# EAGLE schematic pcie-host (EAGLE 8.3.2)
DESIGNER: JON NEWMAN; DESIGN_NAME: PCIE HOST BOARD; LICENSE: CERN OHL v1.2; REVISION: 1.2
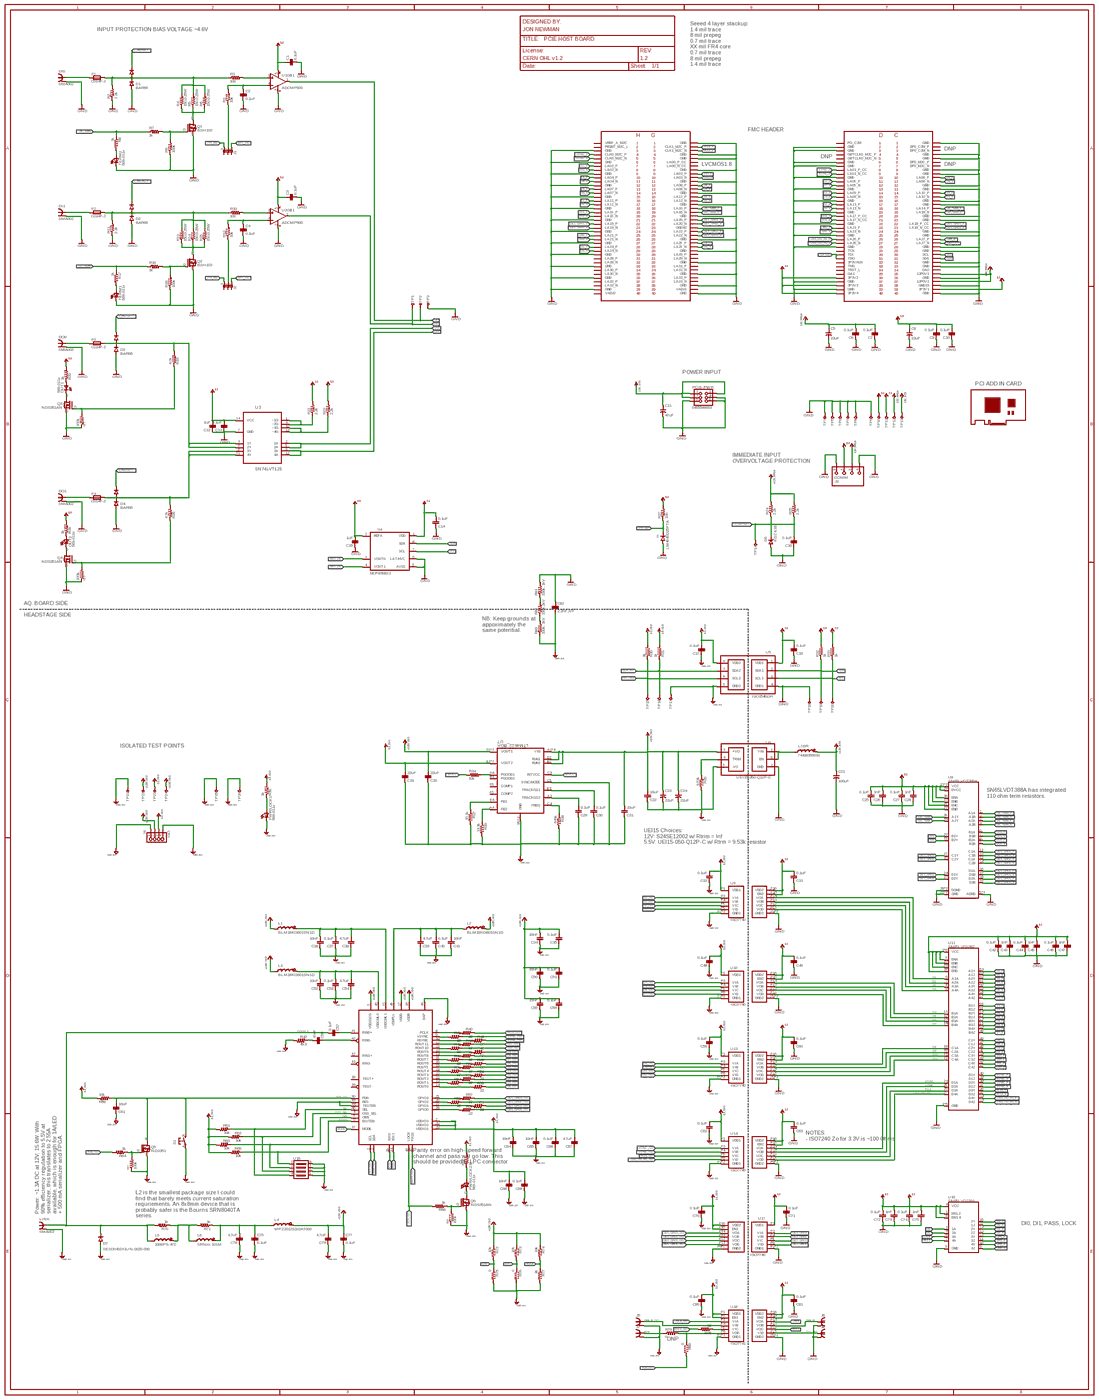
[diagram p0: schematic, sheet 1, overview]
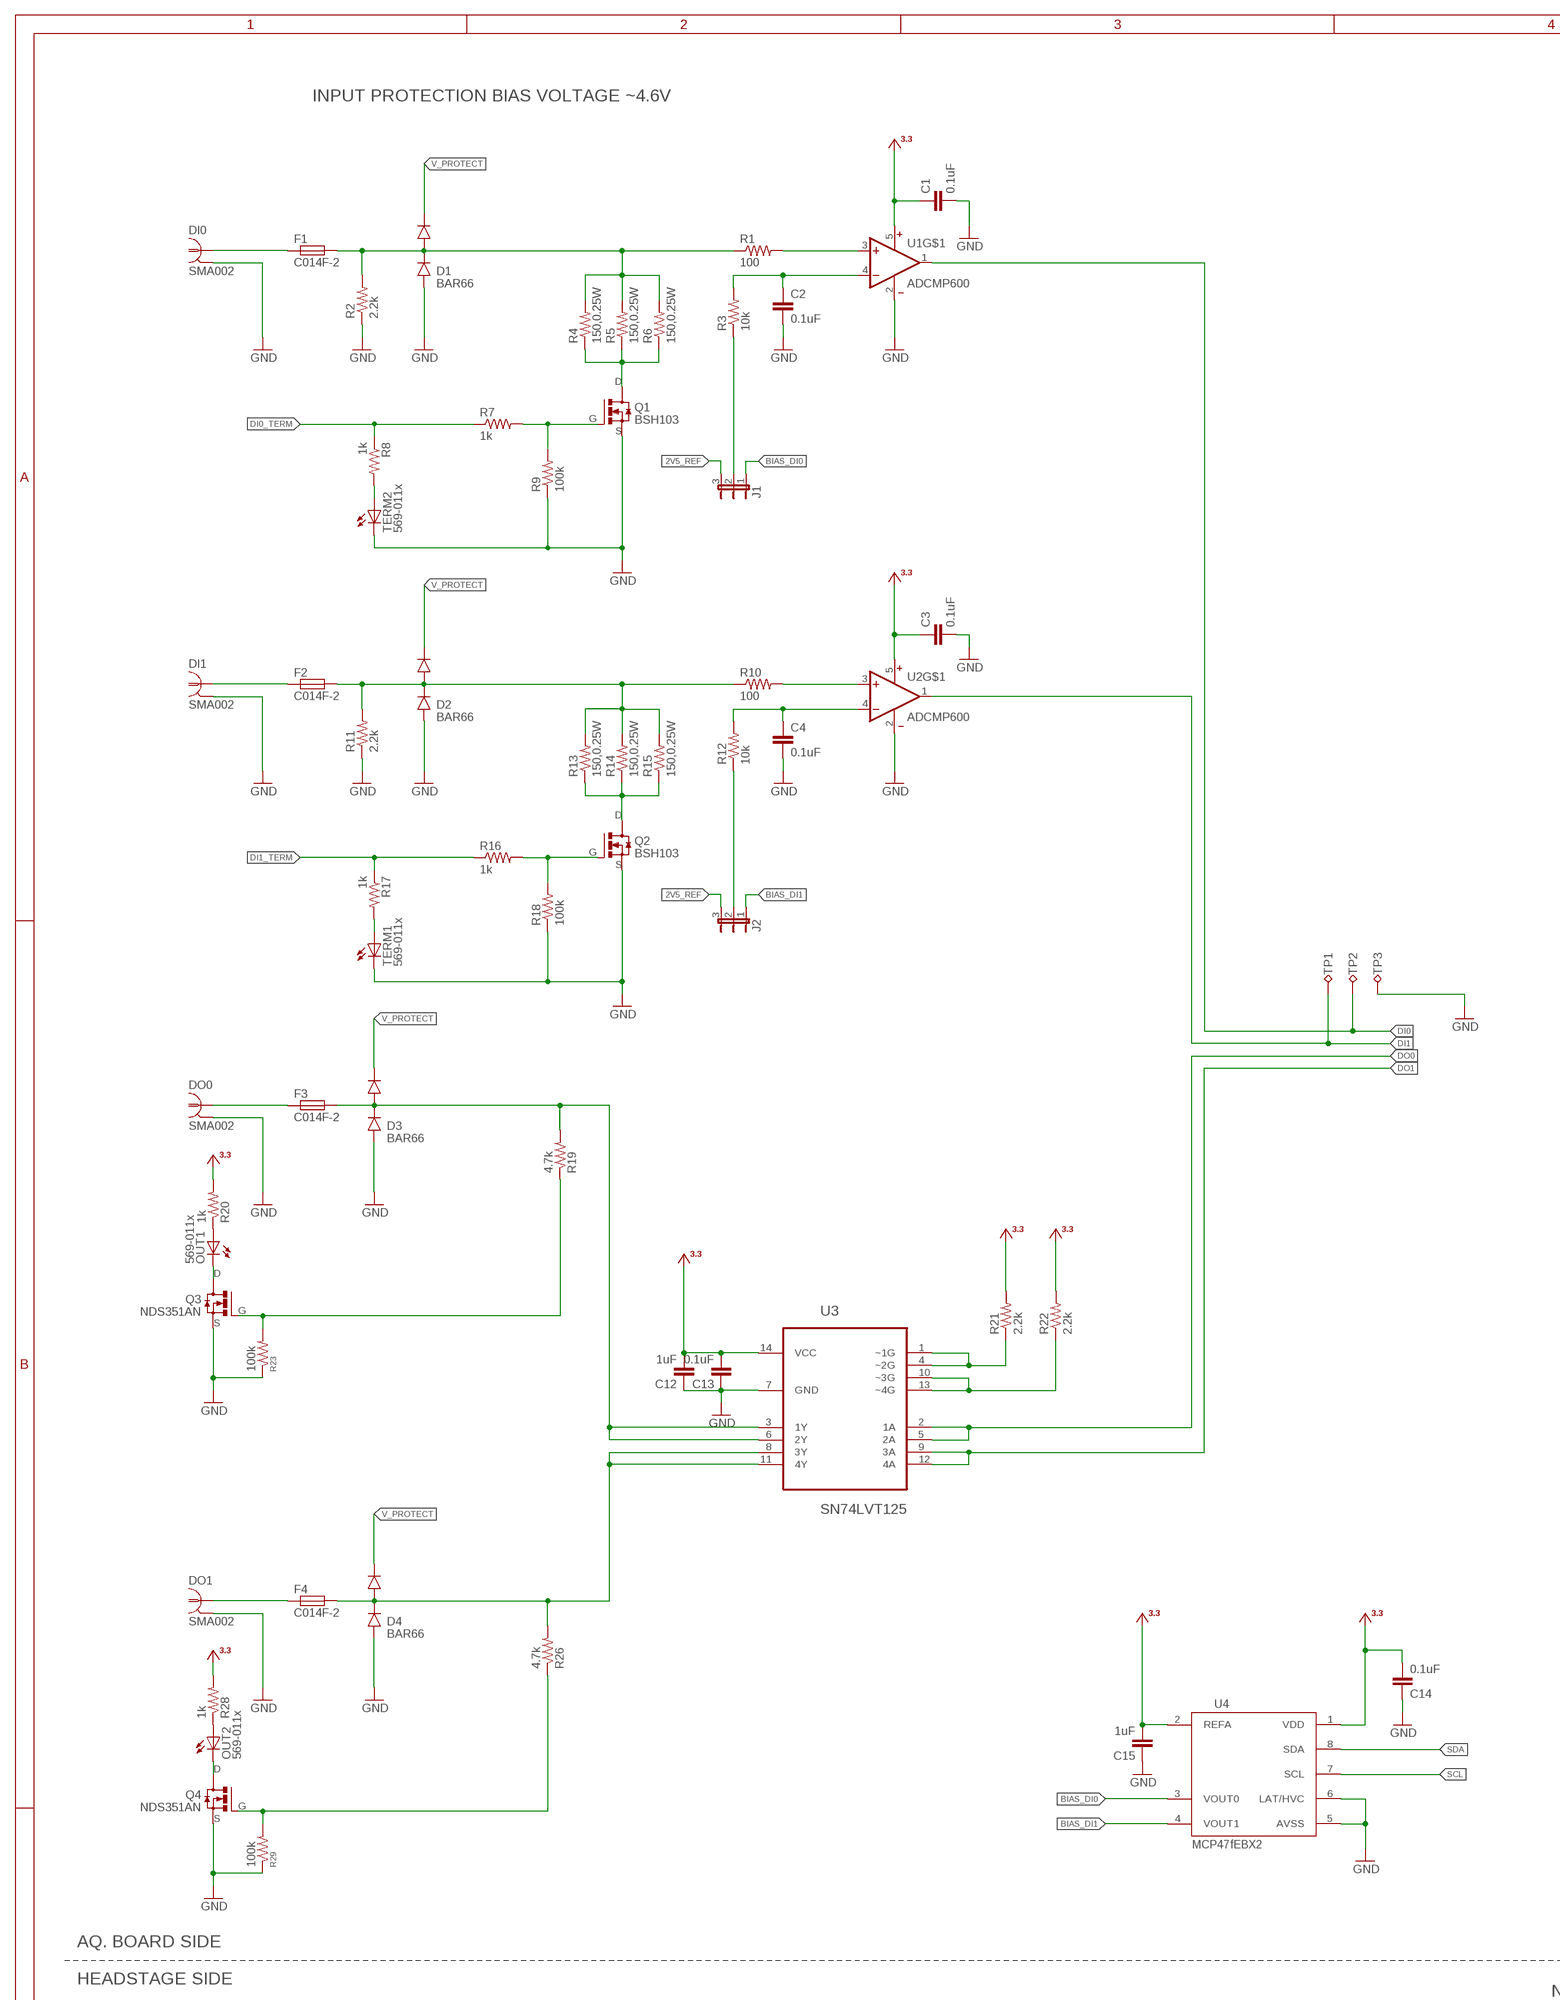
[diagram p1: schematic, sheet 1, part 1 of 4]
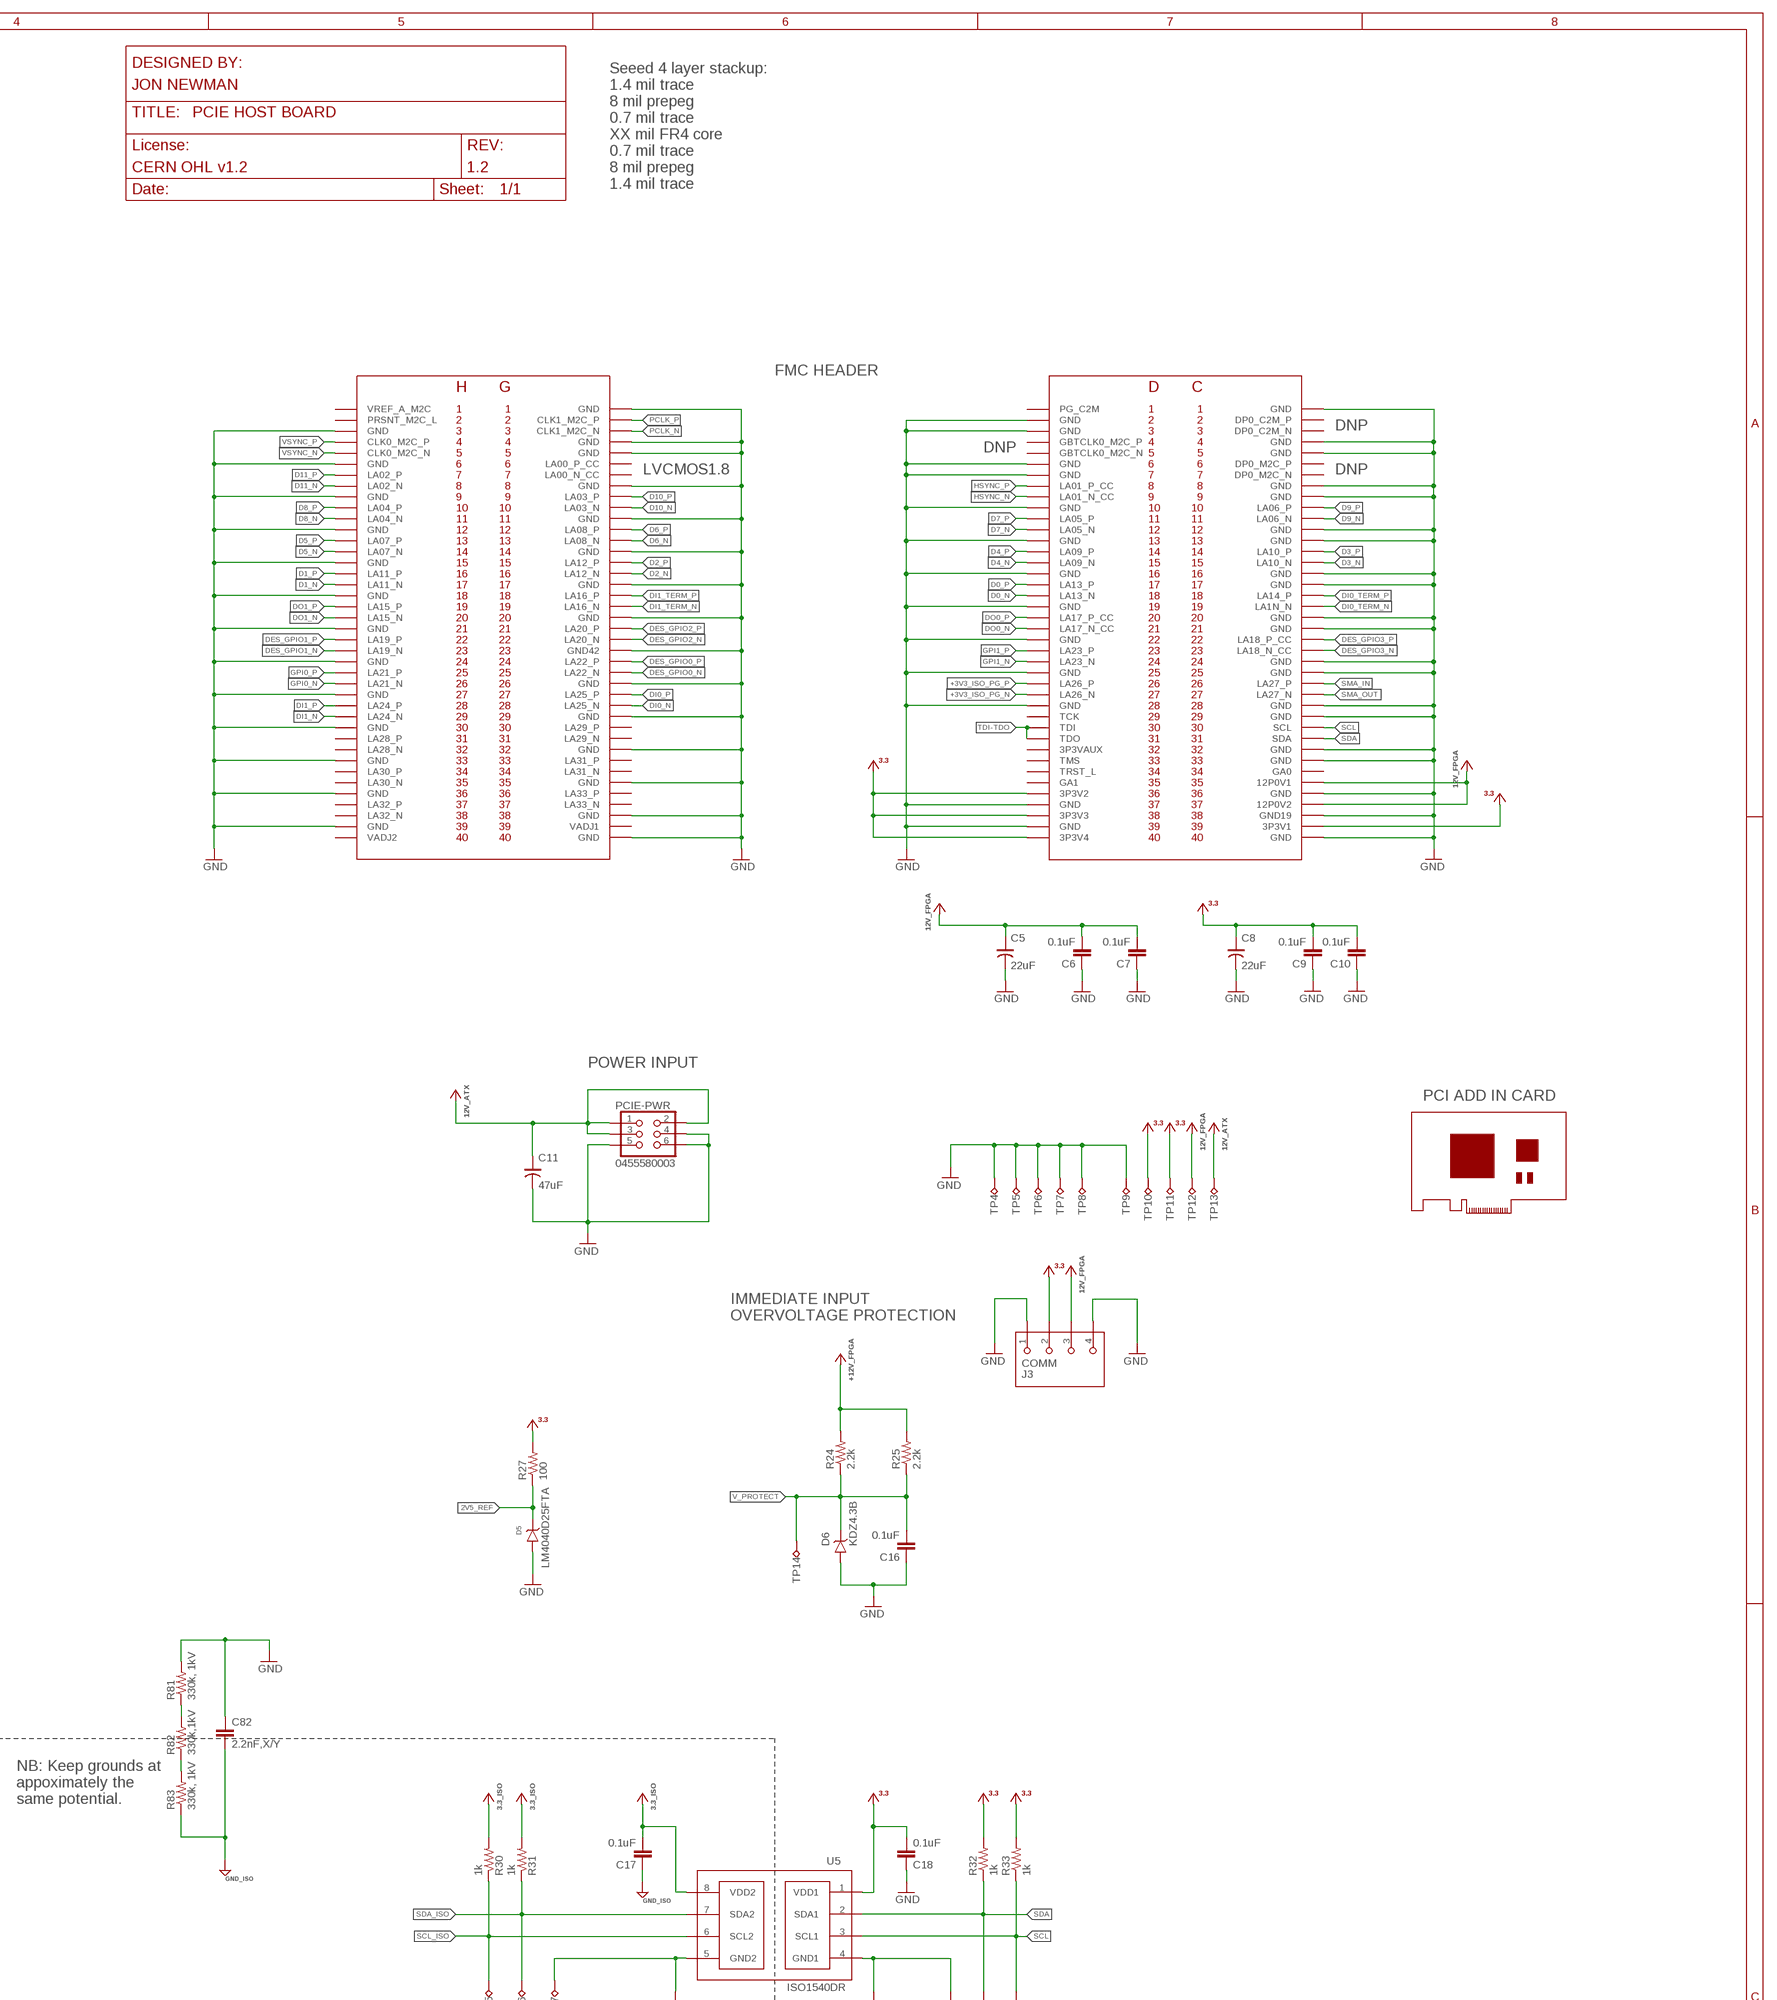
[diagram p2: schematic, sheet 1, part 2 of 4]
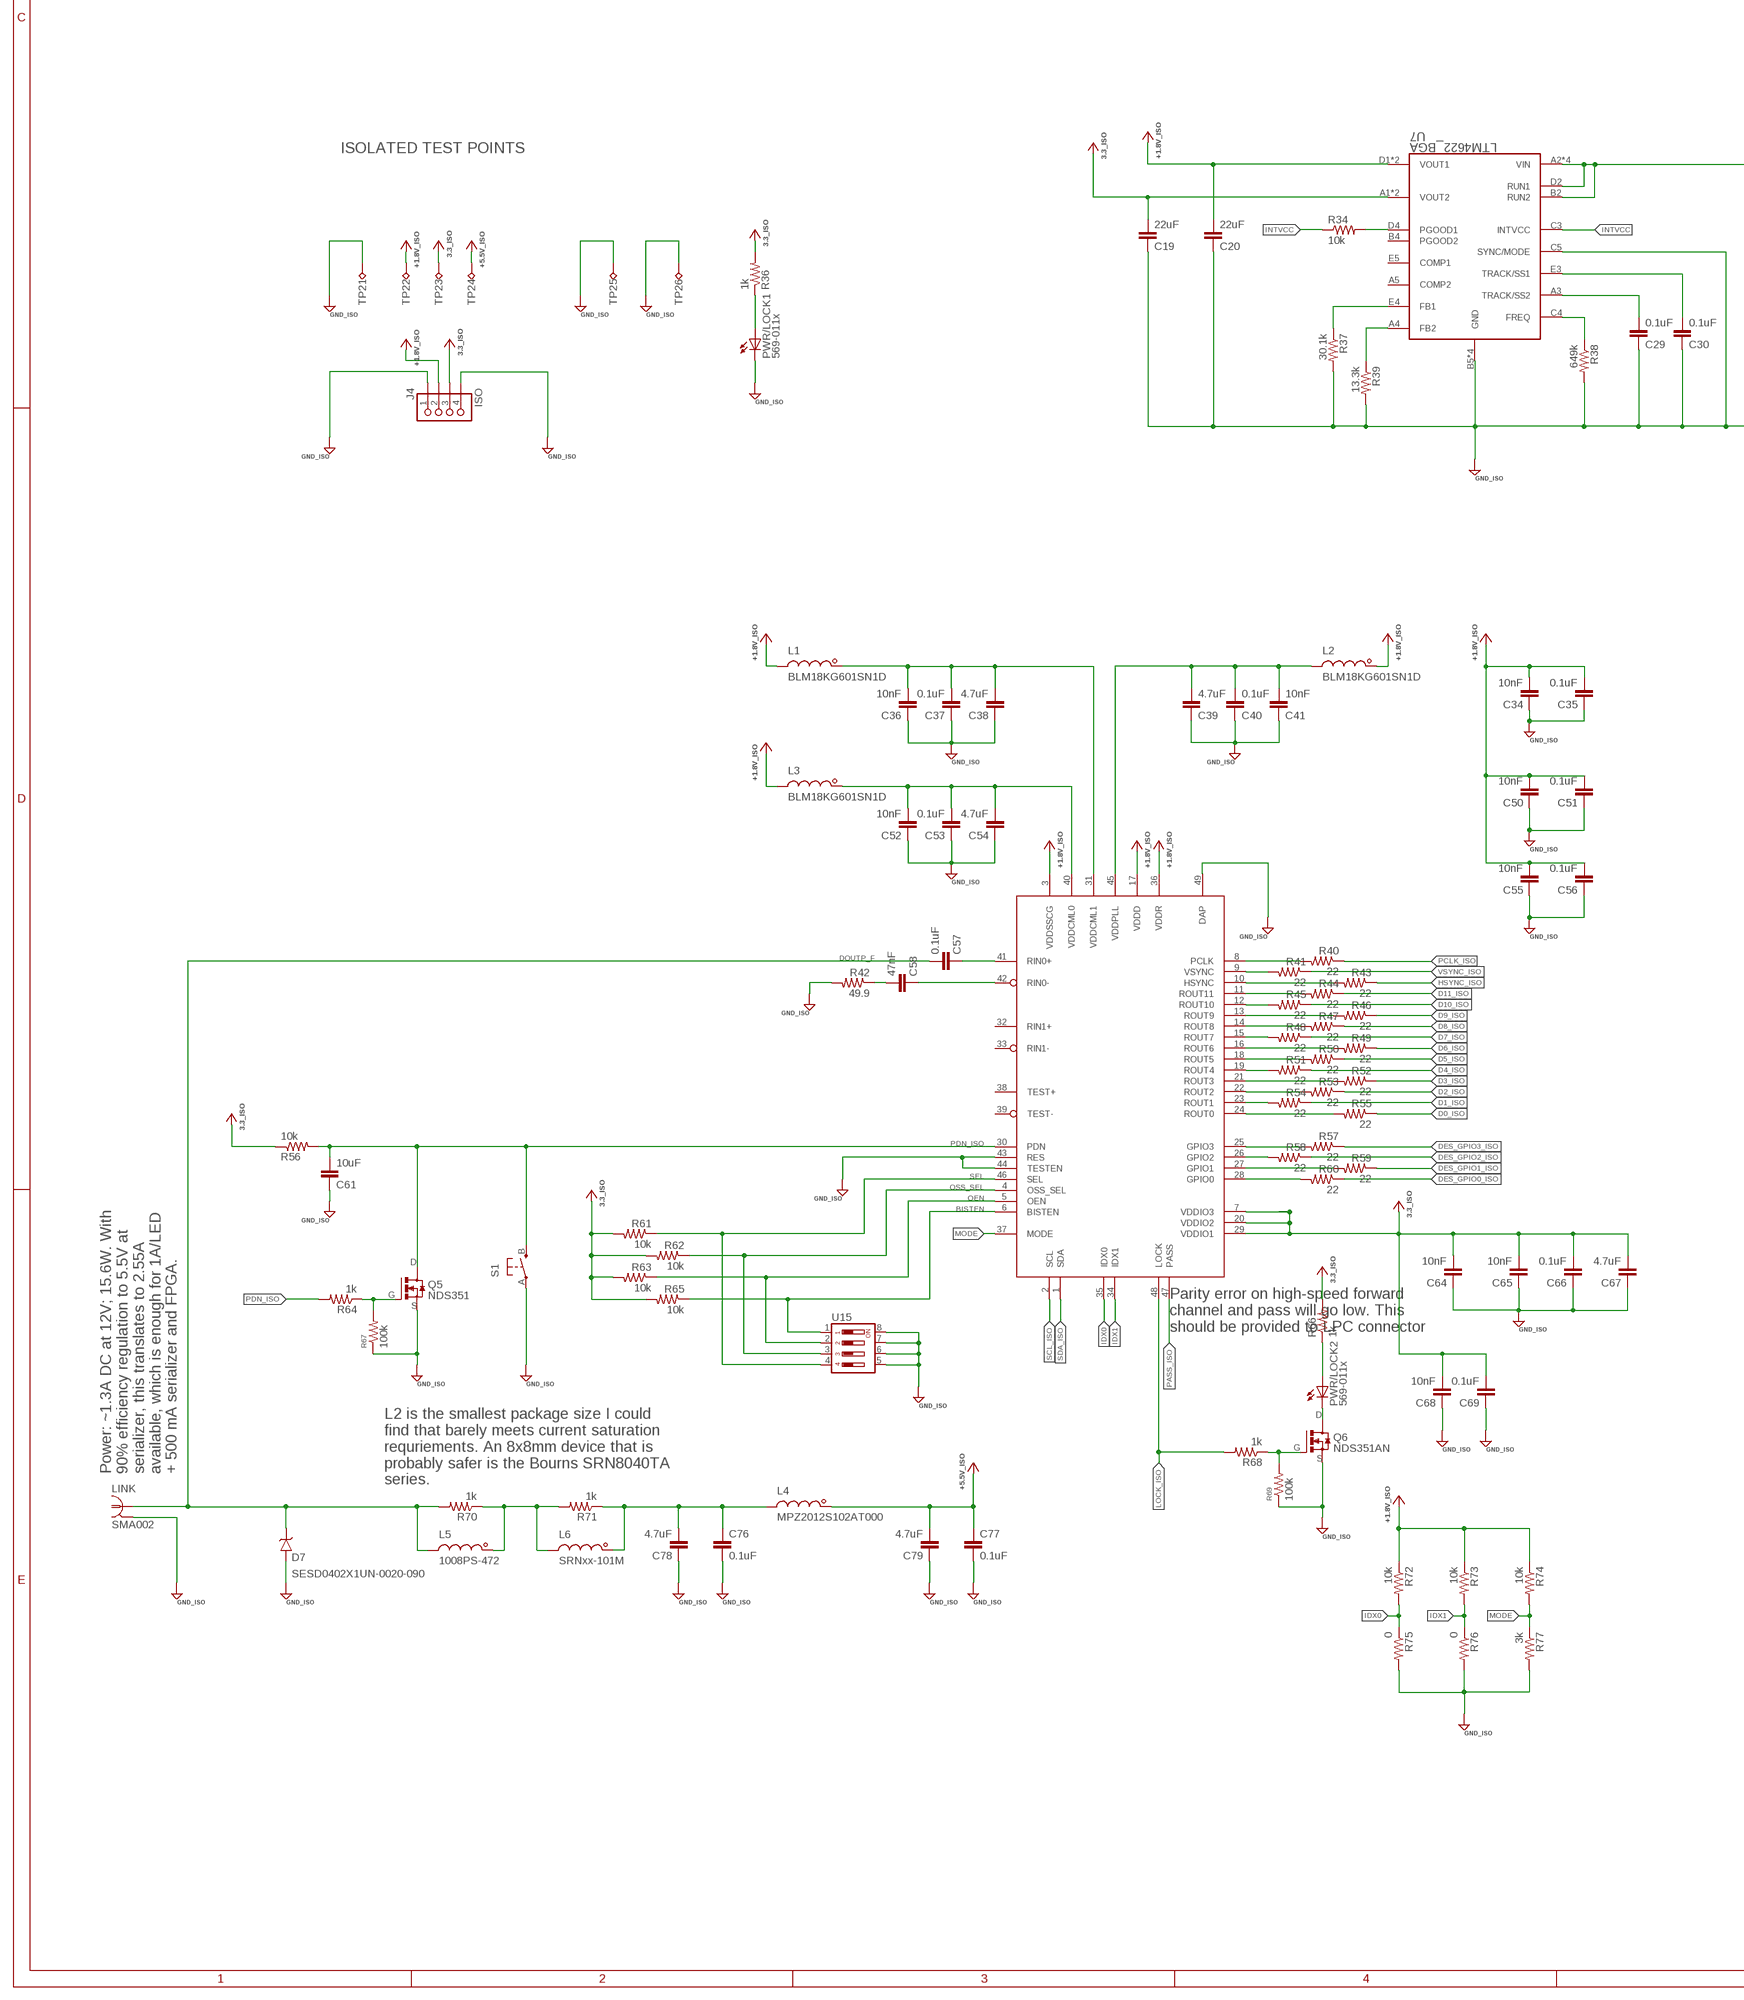
[diagram p3: schematic, sheet 1, part 3 of 4]
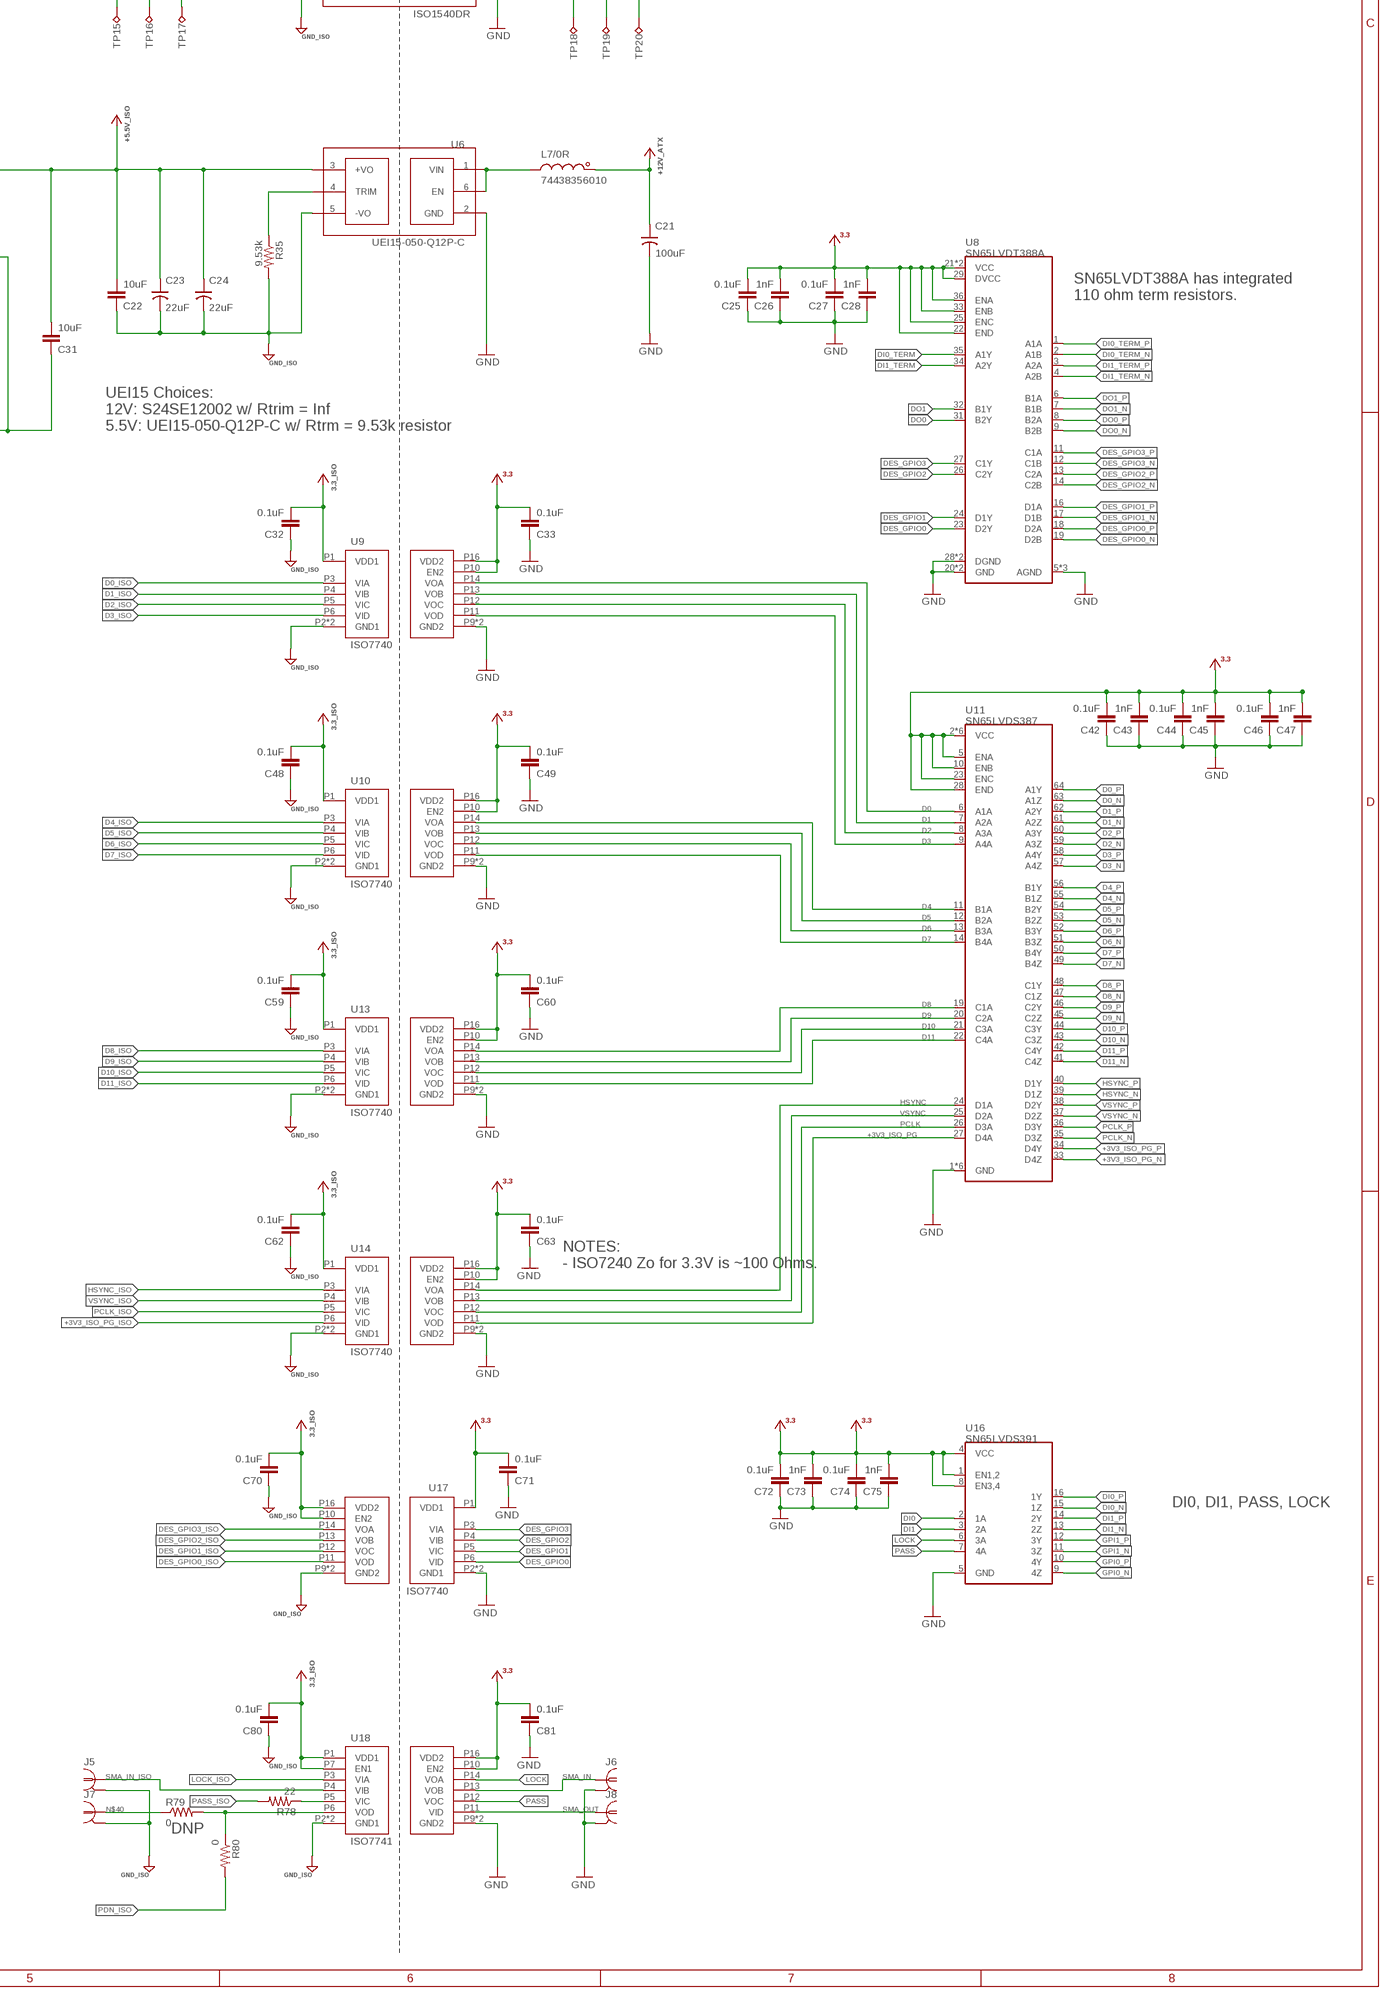
[diagram p4: schematic, sheet 1, part 4 of 4]

## Parts
C1  0.1uF  C_0603  [0603]
C2  0.1uF  C_0603  [0603]
C3  0.1uF  C_0603  [0603]
C4  0.1uF  C_0603  [0603]
C5  22uF  C-POL_1210  [1210-POL]
C6  0.1uF  C_0603  [0603]
C7  0.1uF  C_0603  [0603]
C8  22uF  C-POL_1210  [1210-POL]
C9  0.1uF  C_0603  [0603]
C10  0.1uF  C_0603  [0603]
C11  47uF  C-POL_0807  [153CLV-0807]
C12  1uF  C_0805  [0805]
C13  0.1uF  C_0603  [0603]
C14  0.1uF  C_0603  [0603]
C15  1uF  C_0805  [0805]
C16  0.1uF  C_0603  [0603]
C17  0.1uF  C_0603  [0603]
C18  0.1uF  C_0603  [0603]
C19  22uF  C_1206  [1206]
C20  22uF  C_1206  [1206]
C21  100uF  C-POL_0807  [153CLV-0807]
C22  10uF  C_1206  [1206]
C23  22uF  C-POL_1210  [1210-POL]
C24  22uF  C-POL_1210  [1210-POL]
C25  0.1uF  C_0603  [0603]
C26  1nF  C_0402  [0402]
C27  0.1uF  C_0603  [0603]
C28  1nF  C_0402  [0402]
C29  0.1uF  C_0603  [0603]
C30  0.1uF  C_0603  [0603]
C31  10uF  C_1206  [1206]
C32  0.1uF  C_0603  [0603]
C33  0.1uF  C_0603  [0603]
C34  10nF  C_0402  [0402]
C35  0.1uF  C_0402  [0402]
C36  10nF  C_0402  [0402]
C37  0.1uF  C_0402  [0402]
C38  4.7uF  C_1206  [1206]
C39  4.7uF  C_1206  [1206]
C40  0.1uF  C_0402  [0402]
C41  10nF  C_0402  [0402]
C42  0.1uF  C_0603  [0603]
C43  1nF  C_0402  [0402]
C44  0.1uF  C_0603  [0603]
C45  1nF  C_0402  [0402]
C46  0.1uF  C_0603  [0603]
C47  1nF  C_0402  [0402]
C48  0.1uF  C_0603  [0603]
C49  0.1uF  C_0603  [0603]
C50  10nF  C_0402  [0402]
C51  0.1uF  C_0402  [0402]
C52  10nF  C_0402  [0402]
C53  0.1uF  C_0402  [0402]
C54  4.7uF  C_1206  [1206]
C55  10nF  C_0402  [0402]
C56  0.1uF  C_0402  [0402]
C57  0.1uF  C_0402  [0402]
C58  47nF  C_0402  [0402]
C59  0.1uF  C_0603  [0603]
C60  0.1uF  C_0603  [0603]
C61  10uF  C_1206  [1206]
C62  0.1uF  C_0603  [0603]
C63  0.1uF  C_0603  [0603]
C64  10nF  C_0402  [0402]
C65  10nF  C_0402  [0402]
C66  0.1uF  C_0402  [0402]
C67  4.7uF  C_1206  [1206]
C68  10nF  C_0402  [0402]
C69  0.1uF  C_0402  [0402]
C70  0.1uF  C_0603  [0603]
C71  0.1uF  C_0603  [0603]
C72  0.1uF  C_0603  [0603]
C73  1nF  C_0402  [0402]
C74  0.1uF  C_0603  [0603]
C75  1nF  C_0402  [0402]
C76  0.1uF  C_0603  [0603]
C77  0.1uF  C_0603  [0603]
C78  4.7uF  C_1206  [1206]
C79  4.7uF  C_1206  [1206]
C80  0.1uF  C_0603  [0603]
C81  0.1uF  C_0603  [0603]
C82  2.2nF,X/Y  C_C900  [C900]
D1  BAR66  DIODE2_SOT23  [SOT23]
D2  BAR66  DIODE2_SOT23  [SOT23]
D3  BAR66  DIODE2_SOT23  [SOT23]
D4  BAR66  DIODE2_SOT23  [SOT23]
D5  LM4040D25FTA  Z-DIODE_SOT23  [SOT23]
D6  KDZ4.3B  Z-DIODE_SOD123  [SOD123]
D7  SESD0402X1UN-0020-090  Z-DIODE_0402P-DFN  [0402P-DFN]
DI0  SMA002  COAX_CONREVSMA002-G  [SMA_JACK_CONREVSMA002-G]
DI1  SMA002  COAX_CONREVSMA002-G  [SMA_JACK_CONREVSMA002-G]
DO0  SMA002  COAX_CONREVSMA002-G  [SMA_JACK_CONREVSMA002-G]
DO1  SMA002  COAX_CONREVSMA002-G  [SMA_JACK_CONREVSMA002-G]
F1  C014F-2  FUSE_1812  [1812]
F2  C014F-2  FUSE_1812  [1812]
F3  C014F-2  FUSE_1812  [1812]
F4  C014F-2  FUSE_1812  [1812]
FMC_LPC  FMC_LPC_160_PIN  [FMC_LPC_MALE_WITH_SP601_BSILK]
J1  JP3E  [JP3]
J2  JP3E  [JP3]
J3  COMM  SCREW4  [SCREW4]
J4  ISO  PINHD-1X4  [1X04]
J5  COAX_SMA-VERT-SMA  [SMA_VERT]
J6  COAX_SMA-VERT-SMA  [SMA_VERT]
J7  COAX_SMA-VERT-SMA  [SMA_VERT]
J8  COAX_SMA-VERT-SMA  [SMA_VERT]
L1  BLM18KG601SN1D  L_0603  [0603]
L2  BLM18KG601SN1D  L_0603  [0603]
L3  BLM18KG601SN1D  L_0603  [0603]
L4  MPZ2012S102AT000  L_0805  [0805]
L5  1008PS-472  L_1008PS  [1008PS]
L6  SRNxx-101M  L_SRN6045TA  [SRN6045TA]
L7/0R  74438356010  L_4020  [4020]
LINK  SMA002  COAX_CONREVSMA002-G  [SMA_JACK_CONREVSMA002-G]
OUT  569-011x  LED_2X_VERTICAL  [569-011X-X00_LED_ARRAY]
PCIE-PWR  0455580003  PINHD-2X3_PCIE-PWR  [PCIE-POWER-6PIN]
PWR/LOCK  569-011x  LED_2X_VERTICAL  [569-011X-X00_LED_ARRAY]
Q1  BSH103  N-MOSFET_SOT23-GSD  [SOT23-GSD]
Q2  BSH103  N-MOSFET_SOT23-GSD  [SOT23-GSD]
Q3  NDS351AN  N-MOSFET_SOT23-GSD  [SOT23-GSD]
Q4  NDS351AN  N-MOSFET_SOT23-GSD  [SOT23-GSD]
Q5  NDS351  N-MOSFET_SOT23-GSD  [SOT23-GSD]
Q6  NDS351AN  N-MOSFET_SOT23-GSD  [SOT23-GSD]
R1  100  R_0603  [0603]
R2  2.2k  R_0603  [0603]
R3  10k  R_0603  [0603]
R4  150,0.25W  R_1206  [1206]
R5  150,0.25W  R_1206  [1206]
R6  150,0.25W  R_1206  [1206]
R7  1k  R_0603  [0603]
R8  1k  R_0603  [0603]
R9  100k  R_0603  [0603]
R10  100  R_0603  [0603]
R11  2.2k  R_0603  [0603]
R12  10k  R_0603  [0603]
R13  150,0.25W  R_1206  [1206]
R14  150,0.25W  R_1206  [1206]
R15  150,0.25W  R_1206  [1206]
R16  1k  R_0603  [0603]
R17  1k  R_0603  [0603]
R18  100k  R_0603  [0603]
R19  4.7k  R_0603  [0603]
R20  1k  R_0603  [0603]
R21  2.2k  R_0603  [0603]
R22  2.2k  R_0603  [0603]
R23  100k  R_0603  [0603]
R24  2.2k  R_0603  [0603]
R25  2.2k  R_0603  [0603]
R26  4.7k  R_0603  [0603]
R27  100  R_0603  [0603]
R28  1k  R_0603  [0603]
R29  100k  R_0603  [0603]
R30  1k  R_0603  [0603]
R31  1k  R_0603  [0603]
R32  1k  R_0603  [0603]
R33  1k  R_0603  [0603]
R34  10k  R_0603  [0603]
R35  9.53k  R_0603  [0603]
R36  1k  R_0603  [0603]
R37  30.1k  R_0603  [0603]
R38  649k  R_0603  [0603]
R39  13.3k  R_0603  [0603]
R40  22  R_0402  [0402]
R41  22  R_0402  [0402]
R42  49.9  R_0402  [0402]
R43  22  R_0402  [0402]
R44  22  R_0402  [0402]
R45  22  R_0402  [0402]
R46  22  R_0402  [0402]
R47  22  R_0402  [0402]
R48  22  R_0402  [0402]
R49  22  R_0402  [0402]
R50  22  R_0402  [0402]
R51  22  R_0402  [0402]
R52  22  R_0402  [0402]
R53  22  R_0402  [0402]
R54  22  R_0402  [0402]
R55  22  R_0402  [0402]
R56  10k  R_0402  [0402]
R57  22  R_0402  [0402]
R58  22  R_0402  [0402]
R59  22  R_0402  [0402]
R60  22  R_0402  [0402]
R61  10k  R_0402  [0402]
R62  10k  R_0402  [0402]
R63  10k  R_0402  [0402]
R64  1k  R_0603  [0603]
R65  10k  R_0402  [0402]
R66  1k  R_0603  [0603]
R67  100k  R_0603  [0603]
R68  1k  R_0603  [0603]
R69  100k  R_0603  [0603]
R70  1k  R_0603  [0603]
R71  1k  R_0603  [0603]
R72  10k  R_0402  [0402]
R73  10k  R_0402  [0402]
R74  10k  R_0402  [0402]
R75  0  R_0402  [0402]
R76  0  R_0402  [0402]
R77  3k  R_0402  [0402]
R78  22  R_0402  [0402]
R79  0  R_0402  [0402]
R80  0  R_0402  [0402]
R81  330k, 1kV  R_1206  [1206]
R82  330k,1kV  R_1206  [1206]
R83  330k, 1kV  R_1206  [1206]
S1  SPST_TACT2_EVQPF  [EVQPF]
TERM  569-011x  LED_2X_VERTICAL  [569-011X-X00_LED_ARRAY]
TP1  DI1  TPTP09SQ  [TP09SQ]
TP2  DI0  TPTP09SQ  [TP09SQ]
TP3  GND  TP_0.035IN  [TESTPOINT_0.035IN]
TP4  GND  TP_2MM  [TESTPOINT_2MM]
TP5  GND  TP_2MM  [TESTPOINT_2MM]
TP6  GND  TP_2MM  [TESTPOINT_2MM]
TP7  GND  TP_2MM  [TESTPOINT_2MM]
TP8  GND  TP_2MM  [TESTPOINT_2MM]
TP9  GND  TP_2MM  [TESTPOINT_2MM]
TP10  +3.3V  TP_2MM  [TESTPOINT_2MM]
TP11  +3.3V  TP_2MM  [TESTPOINT_2MM]
TP12  +12V(FPGA)  TP_2MM  [TESTPOINT_2MM]
TP13  +12V(ATX)  TP_2MM  [TESTPOINT_2MM]
TP14  VPROTECT(+4.3V)  TP_0.035IN  [TESTPOINT_0.035IN]
TP15  SCL(ISO)  TP_1MM  [TESTPOINT_1MM]
TP16  SDA(ISO)  TP_1MM  [TESTPOINT_1MM]
TP17  GND(ISO)  TP_1MM  [TESTPOINT_1MM]
TP18  GND  TP_1MM  [TESTPOINT_1MM]
TP19  SDA  TP_1MM  [TESTPOINT_1MM]
TP20  SCL  TP_1MM  [TESTPOINT_1MM]
TP21  GND(ISO)  TP_1MM  [TESTPOINT_1MM]
TP22  +1.8V(ISO)  TP_1MM  [TESTPOINT_1MM]
TP23  +3.3V(ISO)  TP_2MM  [TESTPOINT_2MM]
TP24  +5.5V(ISO)  TP_2MM  [TESTPOINT_2MM]
TP25  GND(ISO)  TP_1MM  [TESTPOINT_1MM]
TP26  GND(ISO)  TP_1MM  [TESTPOINT_1MM]
U1  ADCMP600  COMPARITOR_ADCMP600  [SOT-23-5]
U2  ADCMP600  COMPARITOR_ADCMP600  [SOT-23-5]
U3  SN74LVT125  QUAD-LINE-DRIVER_SOIC  [SO14]
U4  MCP47FEBX2  [TSSOP-8]
U5  ISO1540DR  DIGISO-I2C_SOIC  [SOIC127P500X400-8N]
U6  UEI15-050-Q12P-C  DC-DC-CONVERTER-ADJ_UEI15  [UEI15]
U7  LTM4622_BGA  [BGA_5X5_625X625]
U8  SN65LVDT388A  SN65LVDS388A  [TSSOP-38]
U9  ISO7740  DIGISO-4-0  [SOIC_WIDE_16]
U10  ISO7740  DIGISO-4-0  [SOIC_WIDE_16]
U11  SN65LVDS387  SN65LVDS387_TSSOP  [TSSOP-64]
U12  DS90UB914A-Q1  [WQFN48]
U13  ISO7740  DIGISO-4-0  [SOIC_WIDE_16]
U14  ISO7740  DIGISO-4-0  [SOIC_WIDE_16]
U15  DIPSW-004_SMD-0.05IN  [DIP04-SMD]
U16  SN65LVDS391  [TSSOP-16]
U17  ISO7740  DIGISO-4-0  [SOIC_WIDE_16]
U18  ISO7741  DIGISO-3-1  [SOIC_WIDE_16]
X1  PCI-MECH_STD-H_HALF-W_FMC-STRAIN  [PCI-ADDIN_STD-H_HALF-L_FMC-STRAIN]

## Nets
2V5_REF: D5.1(C) J1.3 J2.3 R27.1
$N1: D2.3(COMM) F2.2 R10.1 R11.2 R13.2 R14.2 R15.2
$N2: D4.3(COMM) F4.2 R26.2 U3.8(3Y) U3.11(4Y)
$N3: D1.3(COMM) F1.2 R1.1 R2.2 R4.2 R5.2 R6.2
$N101: D3.3(COMM) F3.2 R19.2 U3.3(1Y) U3.6(2Y)
+1V8_ISO: C20.2 C34.2 C35.2 C50.2 C51.2 C55.2 C56.2 J4.2 L1.2 L2.1 L3.2 R72.1 R73.1 R74.1 TP22.1(TP) U7.D1(VOUT1) U7.E1(VOUT1) U12.3(VDDSSCG) U12.17(VDDD) U12.36(VDDR)
+3V3: C1.1 C3.1 C8.+ C9.2 C10.2 C12.2 C13.2 C14.2 C15.2 C18.2 C25.2 C26.2 C27.2 C28.2 C33.2 C42.2 C43.2 C44.2 C45.2 C46.2 C47.2 C49.2 C60.2 C63.2 C71.2 C72.2 C73.2 C74.2 C75.2 C81.2 FMC_LPC.P$116(3P3V2) FMC_LPC.P$118(3P3V3) FMC_LPC.P$120(3P3V4) FMC_LPC.P$159(3P3V1) J3.2 R20.2 R21.2 R22.2 R27.2 R28.2 R32.2 R33.2 TP10.1(TP) TP11.1(TP) U1.5(V+) U2.5(V+) U3.14(VCC) U4.1(VDD) U4.2(REFA) U5.1(VDD1) U8.21(VCC) U8.22(END) U8.25(ENC) U8.29(DVCC) U8.33(ENB) U8.36(ENA) U8.37(VCC) U9.P10(EN2) U9.P16(VDD2) U10.P10(EN2) U10.P16(VDD2) U11.2(VCC) U11.3(VCC) U11.5(ENA) U11.10(ENB) U11.16(VCC) U11.17(VCC) U11.23(ENC) U11.28(END) U11.30(VCC) U11.31(VCC) U13.P10(EN2) U13.P16(VDD2) U14.P10(EN2) U14.P16(VDD2) U16.1(EN1,2) U16.4(VCC) U16.8(EN3,4) U17.P1(VDD1) U18.P10(EN2) U18.P16(VDD2)
+3V3_ISO: C17.2 C19.2 C32.2 C48.2 C59.2 C62.2 C64.2 C65.2 C66.2 C67.2 C68.2 C69.2 C70.2 C80.2 J4.3 R30.2 R31.2 R36.2 R56.1 R61.2 R62.2 R63.2 R65.2 R66.2 TP23.1(TP) U5.8(VDD2) U7.A1(VOUT2) U7.B1(VOUT2) U9.P1(VDD1) U10.P1(VDD1) U12.7(VDDIO3) U12.20(VDDIO2) U12.29(VDDIO1) U13.P1(VDD1) U14.P1(VDD1) U17.P10(EN2) U17.P16(VDD2) U18.P1(VDD1) U18.P7(EN1)
+3V3_ISO_PG: U11.27(D4A) U14.P11(VOD)
+3V3_ISO_PG_ISO: R34.2 U7.D4(PGOOD1) U14.P6(VID)
+3V3_ISO_PG_N [diff]: FMC_LPC.P$107(LA26_N) U11.33(D4Z)
+3V3_ISO_PG_P [diff]: FMC_LPC.P$106(LA26_P) U11.34(D4Y)
+5.5V_ISO: C22.2 C23.+ C24.+ C31.2 C77.1 C79.2 L4.1 TP24.1(TP) U6.3(+VO) U7.A2(VIN) U7.B2(RUN2) U7.B3(VIN) U7.D2(RUN1) U7.D3(VIN) U7.E2(VIN)
+12V_ATX: C11.+ C21.+ L7/0R.1 PCIE-PWR.1 PCIE-PWR.2 PCIE-PWR.3 TP13.1(TP)
+12V_FPGA: C5.+ C6.2 C7.2 FMC_LPC.P$155(12P0V1) FMC_LPC.P$157(12P0V2) J3.3 R24.2 R25.2 TP12.1(TP)
BIAS_DI0: J1.1 U4.3(VOUT0)
BIAS_DI1: J2.1 U4.4(VOUT1)
BISTEN: R65.1 U12.6(BISTEN) U15.1
D0: U9.P14(VOA) U11.6(A1A)
D0_ISO: R55.1 U9.P3(VIA)
D0_N [diff]: FMC_LPC.P$98(LA13_N) U11.63(A1Z)
D0_P [diff]: FMC_LPC.P$97(LA13_P) U11.64(A1Y)
D1: U9.P13(VOB) U11.7(A2A)
D1_ISO: R54.1 U9.P4(VIB)
D1_N [diff]: FMC_LPC.P$17(LA11_N) U11.61(A2Z)
D1_P [diff]: FMC_LPC.P$16(LA11_P) U11.62(A2Y)
D2: U9.P12(VOC) U11.8(A3A)
D2_ISO: R53.1 U9.P5(VIC)
D2_N [diff]: FMC_LPC.P$56(LA12_N) U11.59(A3Z)
D2_P [diff]: FMC_LPC.P$55(LA12_P) U11.60(A3Y)
D3: U9.P11(VOD) U11.9(A4A)
D3_ISO: R52.1 U9.P6(VID)
D3_N [diff]: FMC_LPC.P$135(LA10_N) U11.57(A4Z)
D3_P [diff]: FMC_LPC.P$134(LA10_P) U11.58(A4Y)
D4: U10.P14(VOA) U11.11(B1A)
D4_ISO: R51.1 U10.P3(VIA)
D4_N [diff]: FMC_LPC.P$95(LA09_N) U11.55(B1Z)
D4_P [diff]: FMC_LPC.P$94(LA09_P) U11.56(B1Y)
D5: U10.P13(VOB) U11.12(B2A)
D5_ISO: R50.1 U10.P4(VIB)
D5_N [diff]: FMC_LPC.P$14(LA07_N) U11.53(B2Z)
D5_P [diff]: FMC_LPC.P$13(LA07_P) U11.54(B2Y)
D6: U10.P12(VOC) U11.13(B3A)
D6_ISO: R49.1 U10.P5(VIC)
D6_N [diff]: FMC_LPC.P$53(LA08_N) U11.51(B3Z)
D6_P [diff]: FMC_LPC.P$52(LA08_P) U11.52(B3Y)
D7: U10.P11(VOD) U11.14(B4A)
D7_ISO: R48.1 U10.P6(VID)
D7_N [diff]: FMC_LPC.P$92(LA05_N) U11.49(B4Z)
D7_P [diff]: FMC_LPC.P$91(LA05_P) U11.50(B4Y)
D8: U11.19(C1A) U13.P14(VOA)
D8_ISO: R47.1 U13.P3(VIA)
D8_N [diff]: FMC_LPC.P$11(LA04_N) U11.47(C1Z)
D8_P [diff]: FMC_LPC.P$10(LA04_P) U11.48(C1Y)
D9: U11.20(C2A) U13.P13(VOB)
D9_ISO: R46.1 U13.P4(VIB)
D9_N [diff]: FMC_LPC.P$131(LA06_N) U11.45(C2Z)
D9_P [diff]: FMC_LPC.P$130(LA06_P) U11.46(C2Y)
D10: U11.21(C3A) U13.P12(VOC)
D10_ISO: R45.1 U13.P5(VIC)
D10_N [diff]: FMC_LPC.P$50(LA03_N) U11.43(C3Z)
D10_P [diff]: FMC_LPC.P$49(LA03_P) U11.44(C3Y)
D11: U11.22(C4A) U13.P11(VOD)
D11_ISO: R44.1 U13.P6(VID)
D11_N [diff]: FMC_LPC.P$8(LA02_N) U11.41(C4Z)
D11_P [diff]: FMC_LPC.P$7(LA02_P) U11.42(C4Y)
DES_GPIO0: U8.23(D2Y) U17.P6(VID)
DES_GPIO0_ISO: R60.1 U17.P11(VOD)
DES_GPIO0_N [diff]: FMC_LPC.P$65(LA22_N) U8.19(D2B)
DES_GPIO0_P [diff]: FMC_LPC.P$64(LA22_P) U8.18(D2A)
DES_GPIO1: U8.24(D1Y) U17.P5(VIC)
DES_GPIO1_ISO: R59.1 U17.P12(VOC)
DES_GPIO1_N [diff]: FMC_LPC.P$23(LA19_N) U8.17(D1B)
DES_GPIO1_P [diff]: FMC_LPC.P$22(LA19_P) U8.16(D1A)
DES_GPIO2: U8.26(C2Y) U17.P4(VIB)
DES_GPIO2_ISO: R58.1 U17.P13(VOB)
DES_GPIO2_N [diff]: FMC_LPC.P$62(LA20_N) U8.14(C2B)
DES_GPIO2_P [diff]: FMC_LPC.P$61(LA20_P) U8.13(C2A)
DES_GPIO3: U8.27(C1Y) U17.P3(VIA)
DES_GPIO3_ISO: R57.1 U17.P14(VOA)
DES_GPIO3_N [diff]: FMC_LPC.P$143(LA18_N_CC) U8.12(C1B)
DES_GPIO3_P [diff]: FMC_LPC.P$142(LA18_P_CC) U8.11(C1A)
DI0: TP2.TP U1.1(OUT) U16.2(1A)
DI0_N [diff]: FMC_LPC.P$68(LA25_N) U16.15(1Z)
DI0_P [diff]: FMC_LPC.P$67(LA25_P) U16.16(1Y)
DI0_TERM: R7.1 R8.1 U8.35(A1Y)
DI0_TERM_N [diff]: FMC_LPC.P$139(LA1N_N) U8.2(A1B)
DI0_TERM_P [diff]: FMC_LPC.P$138(LA14_P) U8.1(A1A)
DI1: TP1.TP U2.1(OUT) U16.3(2A)
DI1_N [diff]: FMC_LPC.P$29(LA24_N) U16.13(2Z)
DI1_P [diff]: FMC_LPC.P$28(LA24_P) U16.14(2Y)
DI1_TERM: R16.1 R17.1 U8.34(A2Y)
DI1_TERM_N [diff]: FMC_LPC.P$59(LA16_N) U8.4(A2B)
DI1_TERM_P [diff]: FMC_LPC.P$58(LA16_P) U8.3(A2A)
DO0: U3.2(1A) U3.5(2A) U8.31(B2Y)
DO0_N [diff]: FMC_LPC.P$101(LA17_N_CC) U8.9(B2B)
DO0_P [diff]: FMC_LPC.P$100(LA17_P_CC) U8.8(B2A)
DO1: U3.9(3A) U3.12(4A) U8.32(B1Y)
DO1_N [diff]: FMC_LPC.P$20(LA15_N) U8.7(B1B)
DO1_P [diff]: FMC_LPC.P$19(LA15_P) U8.6(B1A)
DOUTP_F: C57.2 D7.C L5.2 LINK.CLK R70.2
GND: C1.2 C2.2 C3.2 C4.2 C5.- C6.1 C7.1 C8.- C9.1 C10.1 C11.- C12.1 C13.1 C14.1 C15.1 C16.1 C18.1 C21.- C25.1 C26.1 C27.1 C28.1 C33.1 C42.1 C43.1 C44.1 C45.1 C46.1 C47.1 C49.1 C60.1 C63.1 C71.1 C72.1 C73.1 C74.1 C75.1 C81.1 C82.1 D1.1(A) D2.1(A) D3.1(A) D4.1(A) D5.2(A) D6.A DI0.GND$1 DI0.GND$2 DI0.GND$3 DI0.GND$4 DI1.GND$1 DI1.GND$2 DI1.GND$3 DI1.GND$4 DO0.GND$1 DO0.GND$2 DO0.GND$3 DO0.GND$4 DO1.GND$1 DO1.GND$2 DO1.GND$3 DO1.GND$4 FMC_LPC.P$3(GND) FMC_LPC.P$6(GND) FMC_LPC.P$9(GND) FMC_LPC.P$12(GND) FMC_LPC.P$15(GND) FMC_LPC.P$18(GND) FMC_LPC.P$21(GND) FMC_LPC.P$24(GND) FMC_LPC.P$27(GND) FMC_LPC.P$30(GND) FMC_LPC.P$33(GND) FMC_LPC.P$36(GND) FMC_LPC.P$39(GND) FMC_LPC.P$41(GND) FMC_LPC.P$44(GND) FMC_LPC.P$45(GND) FMC_LPC.P$48(GND) FMC_LPC.P$51(GND) FMC_LPC.P$54(GND) FMC_LPC.P$57(GND) FMC_LPC.P$60(GND) FMC_LPC.P$63(GND42) FMC_LPC.P$66(GND) FMC_LPC.P$69(GND) FMC_LPC.P$72(GND) FMC_LPC.P$75(GND) FMC_LPC.P$78(GND) FMC_LPC.P$80(GND) FMC_LPC.P$82(GND) FMC_LPC.P$83(GND) FMC_LPC.P$86(GND) FMC_LPC.P$87(GND) FMC_LPC.P$90(GND) FMC_LPC.P$93(GND) FMC_LPC.P$96(GND) FMC_LPC.P$99(GND) FMC_LPC.P$102(GND) FMC_LPC.P$105(GND) FMC_LPC.P$108(GND) FMC_LPC.P$117(GND) FMC_LPC.P$119(GND) FMC_LPC.P$121(GND) FMC_LPC.P$124(GND) FMC_LPC.P$125(GND) FMC_LPC.P$128(GND) FMC_LPC.P$129(GND) FMC_LPC.P$132(GND) FMC_LPC.P$133(GND) FMC_LPC.P$136(GND) FMC_LPC.P$137(GND) FMC_LPC.P$140(GND) FMC_LPC.P$141(GND) FMC_LPC.P$144(GND) FMC_LPC.P$145(GND) FMC_LPC.P$148(GND) FMC_LPC.P$149(GND) FMC_LPC.P$152(GND) FMC_LPC.P$153(GND) FMC_LPC.P$156(GND) FMC_LPC.P$158(GND19) FMC_LPC.P$160(GND) J3.1 J3.4 J6.G1 J6.G2 J6.G3 J6.G4 J8.G1 J8.G2 J8.G3 J8.G4 PCIE-PWR.4 PCIE-PWR.5 PCIE-PWR.6 Q1.S Q2.S Q3.S Q4.S R2.1 R9.1 R11.1 R18.1 R23.1 R29.1 R81.2 TERM.C1(1:C) TERM.C2(2:C) TP3.1(TP) TP4.1(TP) TP5.1(TP) TP6.1(TP) TP7.1(TP) TP8.1(TP) TP9.1(TP) TP18.1(TP) U1.2(V-) U2.2(V-) U3.7(GND) U4.5(AVSS) U4.6(LAT/HVC) U5.4(GND1) U6.2(GND) U8.5(AGND) U8.10(AGND) U8.15(AGND) U8.20(GND) U8.28(DGND) U8.30(DGND) U8.38(GND) U9.P9(GND2) U9.P15(GND2) U10.P9(GND2) U10.P15(GND2) U11.1(GND) U11.4(GND) U11.15(GND) U11.18(GND) U11.29(GND) U11.32(GND) U13.P9(GND2) U13.P15(GND2) U14.P9(GND2) U14.P15(GND2) U16.5(GND) U17.P2(GND1) U17.P8(GND1) U18.P9(GND2) U18.P15(GND2)
GND_ISO: C17.1 C19.1 C20.1 C22.1 C23.- C24.- C29.1 C30.1 C31.1 C32.1 C34.1 C35.1 C36.1 C37.1 C38.1 C39.1 C40.1 C41.1 C48.1 C50.1 C51.1 C52.1 C53.1 C54.1 C55.1 C56.1 C59.1 C61.1 C62.1 C64.1 C65.1 C66.1 C67.1 C68.1 C69.1 C70.1 C76.2 C77.2 C78.1 C79.1 C80.1 C82.2 D7.A J4.1 J4.4 J5.G1 J5.G2 J5.G3 J5.G4 J7.G1 J7.G2 J7.G3 J7.G4 LINK.GND$1 LINK.GND$2 LINK.GND$3 LINK.GND$4 PWR/LOCK.C1(1:C) Q5.S Q6.S R35.2 R37.2 R38.2 R39.2 R42.2 R67.1 R69.1 R75.2 R76.2 R77.2 R83.1 S1.A(P) TP17.1(TP) TP21.1(TP) TP25.1(TP) TP26.1(TP) U5.5(GND2) U6.5(-VO) U7.B5(GND) U7.C1(GND) U7.C2(GND) U7.C5(SYNC/MODE) U7.D5(GND) U9.P2(GND1) U9.P8(GND1) U10.P2(GND1) U10.P8(GND1) U12.43(RES) U12.44(TESTEN) U12.49(DAP) U13.P2(GND1) U13.P8(GND1) U14.P2(GND1) U14.P8(GND1) U15.5 U15.6 U15.7 U15.8 U17.P9(GND2) U17.P15(GND2) U18.P2(GND1) U18.P8(GND1)
GPI0_N [diff]: FMC_LPC.P$26(LA21_N) U16.9(4Z)
GPI0_P [diff]: FMC_LPC.P$25(LA21_P) U16.10(4Y)
GPI1_N [diff]: FMC_LPC.P$104(LA23_N) U16.11(3Z)
GPI1_P [diff]: FMC_LPC.P$103(LA23_P) U16.12(3Y)
HSYNC: U11.24(D1A) U14.P14(VOA)
HSYNC_ISO: R43.1 U14.P3(VIA)
HSYNC_N [diff]: FMC_LPC.P$89(LA01_N_CC) U11.39(D1Z)
HSYNC_P [diff]: FMC_LPC.P$88(LA01_P_CC) U11.40(D1Y)
IDX0: R72.2 R75.1 U12.35(IDX0)
IDX1: R73.2 R76.1 U12.34(IDX1)
INTVCC: R34.1 U7.C3(INTVCC)
LOCK: U16.6(3A) U18.P14(VOA)
LOCK_ISO: R68.2 U12.48(LOCK) U18.P3(VIA)
MODE: R74.2 R77.1 U12.37(MODE)
N$1: Q5.G R64.1 R67.2
N$2: Q1.D R4.1 R5.1 R6.1
N$3: R1.2 U1.3(+IN)
N$4: R40.2 U12.8(PCLK)
N$5: R39.1 U7.A4(FB2)
N$6: DI1.CLK F2.1
N$7: Q2.D R13.1 R14.1 R15.1
N$8: C29.2 U7.A3(TRACK/SS2)
N$9: R17.2 TERM.A1(1:A)
N$10: R37.1 U7.E4(FB1)
N$11: DI0.CLK F1.1
N$12: C30.2 U7.E3(TRACK/SS1)
N$13: R41.2 U12.9(VSYNC)
N$14: DO0.CLK F3.1
N$15: PWR/LOCK.A2(2:A) R66.1
N$16: R43.2 U12.10(HSYNC)
N$17: DO1.CLK F4.1
N$18: C2.1 R3.2 U1.4(-IN)
N$19: R10.2 U2.3(+IN)
N$20: C4.1 R12.2 U2.4(-IN)
N$21: L5.1 L6.2 R70.1 R71.2
N$22: C76.1 C78.2 L4.2 L6.1 R71.1
N$23: OUT.A1(1:A) R20.1
N$24: R21.1 U3.1(~1G) U3.4(~2G)
N$25: R22.1 U3.10(~3G) U3.13(~4G)
N$26: R35.1 U6.4(TRIM)
N$27: C57.1 U12.41(RIN0+)
N$28: C58.1 U12.42(RIN0-)
N$29: PWR/LOCK.C2(2:C) Q6.D
N$30: R8.2 TERM.A2(2:A)
N$31: OUT.A2(2:A) R28.1
N$32: C58.2 R42.1
N$33: PWR/LOCK.A1(1:A) R36.1
N$34: Q2.G R16.2 R18.2
N$35: OUT.C1(1:C) Q3.D
N$36: J2.2 R12.1
N$37: Q1.G R7.2 R9.2
N$38: R57.2 U12.25(GPIO3)
N$39: Q3.G R19.1 R23.2
N$40: J7.SIG R79.1
N$42: R81.1 R82.2
N$43: R82.1 R83.2
N$44: R46.2 U12.13(ROUT9)
N$45: R47.2 U12.14(ROUT8)
N$46: R48.2 U12.15(ROUT7)
N$47: R49.2 U12.16(ROUT6)
N$48: R50.2 U12.18(ROUT5)
N$49: R51.2 U12.19(ROUT4)
N$50: R52.2 U12.21(ROUT3)
N$51: R53.2 U12.22(ROUT2)
N$52: R54.2 U12.23(ROUT1)
N$53: R55.2 U12.24(ROUT0)
N$54: R44.2 U12.11(ROUT11)
N$55: R45.2 U12.12(ROUT10)
N$56: R78.1 U18.P5(VIC)
N$57: R58.2 U12.26(GPIO2)
N$58: R59.2 U12.27(GPIO1)
N$59: R60.2 U12.28(GPIO0)
N$60: OUT.C2(2:C) Q4.D
N$61: Q4.G R26.1 R29.2
N$62: Q6.G R68.1 R69.2
N$136: J1.2 R3.1
N$145: R38.1 U7.C4(FREQ)
OEN: R63.1 U12.5(OEN) U15.2
OSS_SEL: R62.1 U12.4(OSS_SEL) U15.3
PASS: U16.7(4A) U18.P12(VOC)
PASS_ISO: R78.2 U12.47(PASS)
PCLK: U11.26(D3A) U14.P12(VOC)
PCLK_ISO: R40.1 U14.P5(VIC)
PCLK_N [diff]: FMC_LPC.P$43(CLK1_M2C_N) U11.35(D3Z)
PCLK_P [diff]: FMC_LPC.P$42(CLK1_M2C_P) U11.36(D3Y)
PDN_ISO: C61.2 Q5.D R56.2 R64.2 R80.2 S1.B(S) U12.30(PDN)
SCL: FMC_LPC.P$150(SCL) R33.1 TP20.1(TP) U4.7(SCL) U5.3(SCL1)
SCL_ISO: R30.1 TP15.1(TP) U5.6(SCL2) U12.2(SCL)
SDA: FMC_LPC.P$151(SDA) R32.1 TP19.1(TP) U4.8(SDA) U5.2(SDA1)
SDA_ISO: R31.1 TP16.1(TP) U5.7(SDA2) U12.1(SDA)
SEL: R61.1 U12.46(SEL) U15.4
SMA_IN: FMC_LPC.P$146(LA27_P) J6.SIG U18.P13(VOB)
SMA_IN_ISO: J5.SIG U18.P4(VIB)
SMA_OUT: FMC_LPC.P$147(LA27_N) J8.SIG U18.P11(VID)
SMA_OUT_ISO: R79.2 R80.1 U18.P6(VOD)
TDI-TDO: FMC_LPC.P$110(TDI) FMC_LPC.P$111(TDO)
V_PROTECT: C16.2 D1.2(C) D2.2(C) D3.2(C) D4.2(C) D6.C R24.1 R25.1 TP14.1(TP)
VDDCML0: C52.2 C53.2 C54.2 L3.1 U12.40(VDDCML0)
VDDCML1: C36.2 C37.2 C38.2 L1.1 U12.31(VDDCML1)
VDDPLL: C39.2 C40.2 C41.2 L2.2 U12.45(VDDPLL)
VIN: L7/0R.2 U6.1(VIN) U6.6(EN)
VSYNC: U11.25(D2A) U14.P13(VOB)
VSYNC_ISO: R41.1 U14.P4(VIB)
VSYNC_N [diff]: FMC_LPC.P$5(CLK0_M2C_N) U11.37(D2Z)
VSYNC_P [diff]: FMC_LPC.P$4(CLK0_M2C_P) U11.38(D2Y)
Unconnected: FMC_LPC.P$1(VREF_A_M2C) FMC_LPC.P$2(PRSNT_M2C_L) FMC_LPC.P$31(LA28_P) FMC_LPC.P$32(LA28_N) FMC_LPC.P$34(LA30_P) FMC_LPC.P$35(LA30_N) FMC_LPC.P$37(LA32_P) FMC_LPC.P$38(LA32_N) FMC_LPC.P$40(VADJ2) FMC_LPC.P$46(LA00_P_CC) FMC_LPC.P$47(LA00_N_CC) FMC_LPC.P$70(LA29_P) FMC_LPC.P$71(LA29_N) FMC_LPC.P$73(LA31_P) FMC_LPC.P$74(LA31_N) FMC_LPC.P$76(LA33_P) FMC_LPC.P$77(LA33_N) FMC_LPC.P$79(VADJ1) FMC_LPC.P$81(PG_C2M) FMC_LPC.P$84(GBTCLK0_M2C_P) FMC_LPC.P$85(GBTCLK0_M2C_N) FMC_LPC.P$109(TCK) FMC_LPC.P$112(3P3VAUX) FMC_LPC.P$113(TMS) FMC_LPC.P$114(TRST_L) FMC_LPC.P$115(GA1) FMC_LPC.P$122(DP0_C2M_P) FMC_LPC.P$123(DP0_C2M_N) FMC_LPC.P$126(DP0_M2C_P) FMC_LPC.P$127(DP0_M2C_N) FMC_LPC.P$154(GA0) U7.A5(COMP2) U7.B4(PGOOD2) U7.E5(COMP1) U12.32(RIN1+) U12.33(RIN1-) U12.38(TEST+) U12.39(TEST-)

## Notes on the sheet
- INPUT PROTECTION BIAS VOLTAGE ~4.6V
- Seeed 4 layer stackup:
  1.4 mil trace
  8 mil prepeg
  0.7 mil trace
  XX mil FR4 core
  0.7 mil trace
  8 mil prepeg
  1.4 mil trace
- FMC HEADER
- DNP
- DNP
- LVCMOS1.8 | DNP
- POWER INPUT
- PCI ADD IN CARD
- IMMEDIATE INPUT 
  OVERVOLTAGE PROTECTION
- AQ. BOARD SIDE
- HEADSTAGE SIDE
- NB: Keep grounds at 
  appoximately the 
  same potential.
- ISOLATED TEST POINTS
- SN65LVDT388A has integrated
  110 ohm term resistors.
- UEI15 Choices:
  12V: S24SE12002 w/ Rtrim = Inf
  5.5V: UEI15-050-Q12P-C w/ Rtrm = 9.53k resistor
- NOTES:
  - ISO7240 Zo for 3.3V is ~100 Ohms.
- Parity error on high-speed forward
  channel and pass will go low. This
  should be provided to LPC connector
- Power: ~1.3A DC at 12V; 15.6W. With
  90% efficiency regulation to 5.5V at
  serializer, this translates to 2.55A
  available, which is enough for 1A/LED 
  + 500 mA serializer and FPGA.
- L2 is the smallest package size I could
  find that barely meets current saturation
  requriements. An 8x8mm device that is
  probably safer is the Bourns SRN8040TA
  series.
- DI0, DI1, PASS, LOCK
- DNP

## Power pins joined to a net without a drawn wire
GND: FMC_LPC.GNDA(GND$1:GND) FMC_LPC.GNDB(GND$2:GND)

## Library data of the parts
C1-C4 C6 C7 C9 C10 C16-C20 C22 C25-C82 = jonnew:C: Capacitor
C5 C8 C11 C21 C23 C24 = jonnew:C-POL: Polarized Capacitor
C12 C15 = jonnew:C: Capacitor; MN: TDK Corp.; PARTNO: C2012X5R1Cxxxxxxx; VID: DK
C13 C14 = RHD2000_eval_board:C: Capacitor
D1-D4 = jonnew:DIODE2
D5-D7 = jonnew:Z-DIODE: Zener Diode
DI0 DI1 DO0 DO1 J5-J8 LINK = jonnew:COAX: COAX CONNECTOR - Edge mount BNC - Vertical BNC - Vertical SMA - etc
F1-F4 = jonnew:FUSE
FMC_LPC = jonnew:FMC_LPC_160_PIN
J1 J2 = jonnew:JP3E
J3 = jonnew:SCREW4: Screw Terminal
J4 = jonnew:PINHD-1X4
L1-L6 L7/0R = jonnew:L: Inductor
OUT PWR/LOCK TERM = jonnew:LED_2X
PCIE-PWR = jonnew:PINHD-2X3
Q1-Q6 = jonnew:N-MOSFET: N-CHANNEL MOS FET SYMBOL
R1-R3 R7-R12 R16 R18 R21 R22 R24 R25 R27 R30-R35 R37-R39 R64 R67 R70 R71 = jonnew:R: Resistor; DK: PxxxxHTR-ND; MN: Panasonic; MPN: ERJ-3EKFxxxxV
R4-R6 R13-R15 R40-R63 R65 R72-R83 = jonnew:R: Resistor
R17 = RHD2000_eval_board:R: Resistor
R19 R20 R23 R26 R28 R29 R36 R66 R68 R69 = cyclops:R: Resistor; DK: PxxxxHTR-ND; MN: Panasonic; MPN: ERJ-3EKFxxxxV
S1 = jonnew:SPST_TACT2
TP1-TP26 = jonnew:TP: Test pad
U1 U2 = jonnew:COMPARITOR
U3 = jonnew:QUAD-LINE-DRIVER
U4 = jonnew:MCP47FEBX2
U5 = jonnew:DIGISO-I2C
U6 = jonnew:DC-DC-CONVERTER-ADJ
U7 = jonnew:LTM4622
U8 = jonnew:SN65LVDS388A
U9 U10 U13 U14 U17 = jonnew:DIGISO-4-0
U11 = jonnew:SN65LVDS387
U12 = jonnew:DS90UB914A-Q1
U15 = jonnew:DIPSW-004
U16 = jonnew:SN65LVDS391
U18 = jonnew:DIGISO-3-1
X1 = jonnew:PCI-MECH

## Net classes
1 diff: width 0.229 mm, drill 0.33 mm, clearance 0.127 mm